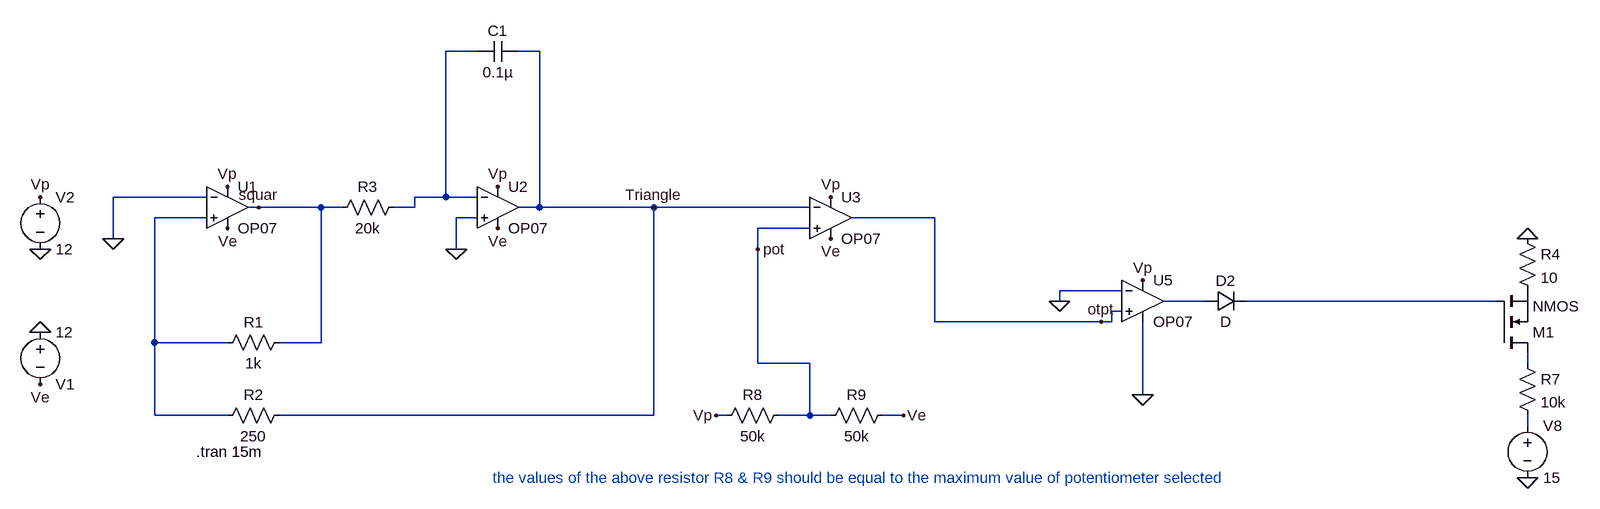
[diagram p0: schematic Encore_Sol_LT_spice.asc]
Encore_Sol_LT_spice.asc, the LTspice schematic file:
Version 4
SHEET 1 2760 1348
WIRE 192 -96 144 -96
WIRE 288 -96 256 -96
WIRE -224 128 -368 128
WIRE 144 128 144 -96
WIRE 144 128 96 128
WIRE 192 128 144 128
WIRE -144 144 -160 144
WIRE -48 144 -144 144
WIRE -16 144 -48 144
WIRE 96 144 96 128
WIRE 96 144 64 144
WIRE 288 144 288 -96
WIRE 288 144 256 144
WIRE 464 144 288 144
WIRE 704 144 464 144
WIRE -224 160 -304 160
WIRE 192 160 160 160
WIRE 896 160 768 160
WIRE 704 176 624 176
WIRE -368 192 -368 128
WIRE 160 208 160 160
WIRE 624 208 624 176
WIRE 1184 272 1088 272
WIRE 1088 288 1088 272
WIRE 1312 288 1248 288
WIRE 1760 288 1376 288
WIRE 1184 304 1168 304
WIRE 896 320 896 160
WIRE 1152 320 896 320
WIRE 1168 320 1168 304
WIRE 1168 320 1152 320
WIRE -304 352 -304 160
WIRE -192 352 -304 352
WIRE -48 352 -48 144
WIRE -48 352 -112 352
WIRE 624 384 624 208
WIRE 704 384 624 384
WIRE 1808 384 1808 368
WIRE 1216 432 1216 320
WIRE -304 464 -304 352
WIRE -192 464 -304 464
WIRE 464 464 464 144
WIRE 464 464 -112 464
WIRE 576 464 560 464
WIRE 704 464 704 384
WIRE 704 464 656 464
WIRE 736 464 704 464
WIRE 848 464 816 464
WIRE 1808 480 1808 464
FLAG 464 144 Triangle
FLAG -144 144 squar
FLAG 624 208 pot
FLAG 1808 560 0
FLAG 1808 192 0
FLAG -480 336 0
FLAG -480 208 0
FLAG -480 416 Ve
FLAG -192 176 Ve
FLAG 224 176 Ve
FLAG 736 192 Ve
FLAG -480 128 Vp
FLAG -192 112 Vp
FLAG 736 128 Vp
FLAG -368 192 0
FLAG 160 208 0
FLAG 224 112 Vp
FLAG 1152 320 otpt
FLAG 1216 256 Vp
FLAG 1088 288 0
FLAG 1216 432 0
FLAG 848 464 Ve
FLAG 560 464 Vp
SYMBOL OpAmps\\OP07 -192 80 R0
SYMATTR InstName U1
SYMBOL OpAmps\\OP07 224 80 R0
SYMATTR InstName U2
SYMBOL voltage -480 320 R0
WINDOW 0 24 96 Left 2
WINDOW 3 24 16 Left 2
WINDOW 123 0 0 Left 0
WINDOW 39 0 0 Left 0
SYMATTR InstName V1
SYMATTR Value 12
SYMBOL voltage -480 112 R0
SYMATTR InstName V2
SYMATTR Value 12
SYMBOL res -96 336 R90
WINDOW 0 0 56 VBottom 2
WINDOW 3 32 56 VTop 2
SYMATTR InstName R1
SYMATTR Value 1k
SYMBOL res -96 448 R90
WINDOW 0 0 56 VBottom 2
WINDOW 3 32 56 VTop 2
SYMATTR InstName R2
SYMATTR Value 250
SYMBOL res 80 128 R90
WINDOW 0 0 56 VBottom 2
WINDOW 3 32 56 VTop 2
SYMATTR InstName R3
SYMATTR Value 20k
SYMBOL cap 256 -112 R90
WINDOW 0 0 32 VBottom 2
WINDOW 3 32 32 VTop 2
SYMATTR InstName C1
SYMATTR Value 0.1µ
SYMBOL OpAmps\\OP07 736 96 R0
SYMATTR InstName U3
SYMBOL nmos 1760 368 M180
SYMATTR InstName M1
SYMBOL voltage 1808 464 R0
SYMATTR InstName V8
SYMATTR Value 15
SYMBOL res 1792 176 R0
SYMATTR InstName R4
SYMATTR Value 10
SYMBOL res 1792 368 R0
SYMATTR InstName R7
SYMATTR Value 10k
SYMBOL res 672 448 R90
WINDOW 0 0 56 VBottom 2
WINDOW 3 32 56 VTop 2
SYMATTR InstName R8
SYMATTR Value 50k
SYMBOL res 832 448 R90
WINDOW 0 0 56 VBottom 2
WINDOW 3 32 56 VTop 2
SYMATTR InstName R9
SYMATTR Value 50k
SYMBOL OpAmps\\OP07 1216 224 R0
SYMATTR InstName U5
SYMBOL diode 1312 304 R270
WINDOW 0 32 32 VTop 2
WINDOW 3 0 32 VBottom 2
SYMATTR InstName D2
TEXT -240 520 Left 2 !.tran 15m
TEXT 216 560 Left 2 ;the values of the above resistor R8 & R9 should be equal to the maximum value of potentiometer selected

The netlist it stands for:
* Encore_Sol_LT_spice.asc
XU1 N002 0 Vp Ve squar LT1001  ; OP07, pins In+ In- V+ V- OUT
XU2 0 N001 Vp Ve Triangle LT1001  ; OP07, pins In+ In- V+ V- OUT
V1 0 Ve 12
V2 Vp 0 12
R1 squar N002 1k
R2 Triangle N002 250
R3 N001 squar 20k
C1 Triangle N001 0.1µ
XU3 pot Triangle Vp Ve otpt LT1001  ; OP07, pins In+ In- V+ V- OUT
M1 N005 N004 P001 P001 NMOS
V8 N006 0 15
R4 0 P001 10
R7 N005 N006 10k
R8 pot Vp 50k
R9 Ve pot 50k
XU5 otpt 0 Vp 0 N003 LT1001  ; OP07, pins In+ In- V+ V- OUT
D2 N003 N004 D
.model D D
.lib standard.dio
.model NMOS NMOS
.model PMOS PMOS
.lib standard.mos
.tran 15m
* the values of the above resistor R8 & R9 should be equal to the maximum value of potentiometer selected
.lib LTC.lib
.backanno
.end